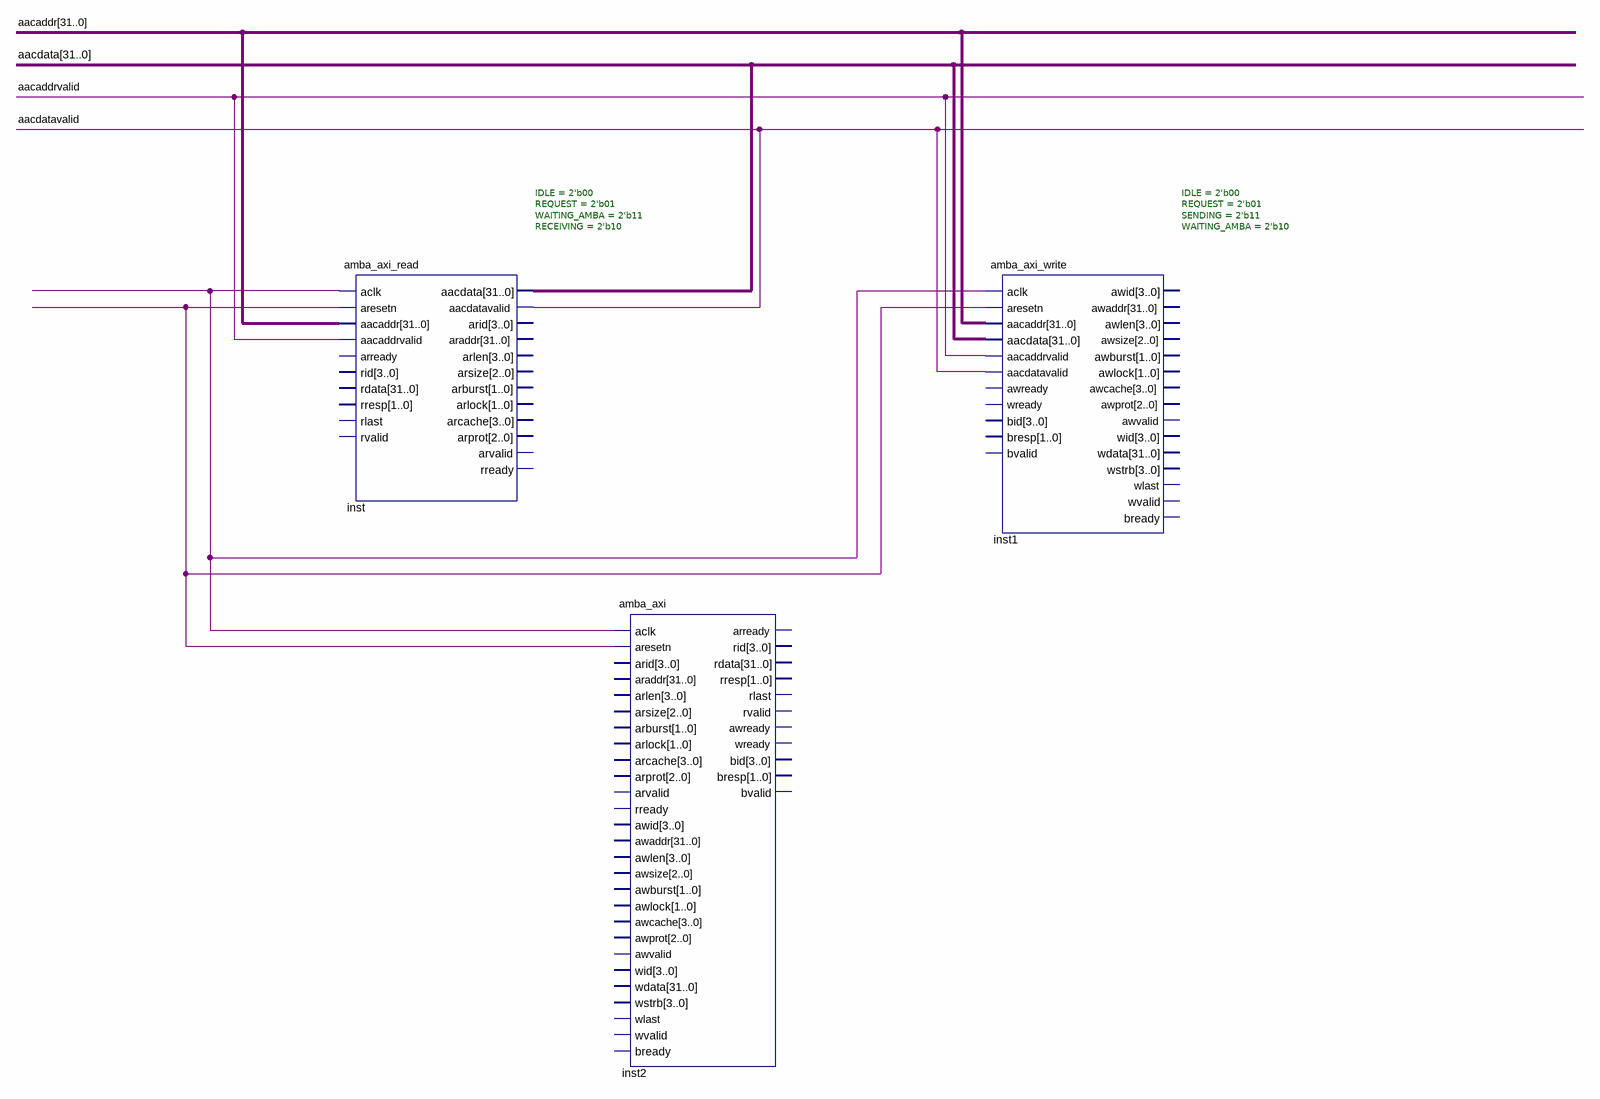
[diagram p0: schematic sheet]
// Quartus schematic esquematico.bdf as structural Verilog: 3 symbols, 0 pins
module esquematico (
);

  wire aacaddrvalid, aacdatavalid, undriven, undriven_2;
  wire [31:0] aacaddr, aacdata;

  amba_axi_read #(.IDLE(2'b00), .REQUEST(2'b01), .WAITING_AMBA(2'b11), .RECEIVING(2'b10)) inst (
    .aclk(undriven), .aresetn(undriven_2), .aacaddr(aacaddr), .aacaddrvalid(aacaddrvalid), .aacdata(aacdata),
    .aacdatavalid(aacdatavalid));  // open: arready, rid, rdata, rresp, rlast, rvalid, arid, araddr, arlen, arsize, arburst, arlock, arcache, arprot, arvalid, rready
  amba_axi inst2 (
    .aclk(undriven), .aresetn(undriven_2));  // open: arid, araddr, arlen, arsize, arburst, arlock, arcache, arprot, arvalid, rready, awid, awaddr, awlen, awsize, awburst, awlock, awcache, awprot, awvalid, wid, wdata, wstrb, wlast, wvalid, bready, arready, rid, rdata, rresp, rlast, rvalid, awready, wready, bid, bresp, bvalid
  amba_axi_write #(.IDLE(2'b00), .REQUEST(2'b01), .SENDING(2'b11), .WAITING_AMBA(2'b10)) inst1 (
    .aclk(undriven), .aresetn(undriven_2), .aacaddr(aacaddr), .aacdata(aacdata), .aacaddrvalid(aacaddrvalid),
    .aacdatavalid(aacdatavalid));  // open: awready, wready, bid, bresp, bvalid, awid, awaddr, awlen, awsize, awburst, awlock, awcache, awprot, awvalid, wid, wdata, wstrb, wlast, wvalid, bready
endmodule
